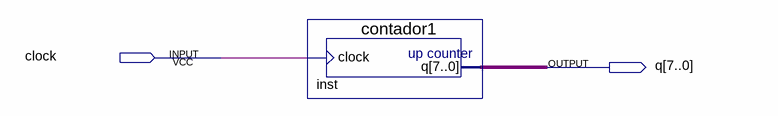
[diagram p0: schematic sheet]
// Quartus schematic projeto00.bdf as structural Verilog: 1 symbols, 2 pins
module projeto00 (
  input  clock,
  output [7:0] q
);

  contador1 inst (.clock(clock), .q(q));
endmodule
